# EAGLE design ATmega128RFA1-DevBoard (EAGLE 7.5.0)
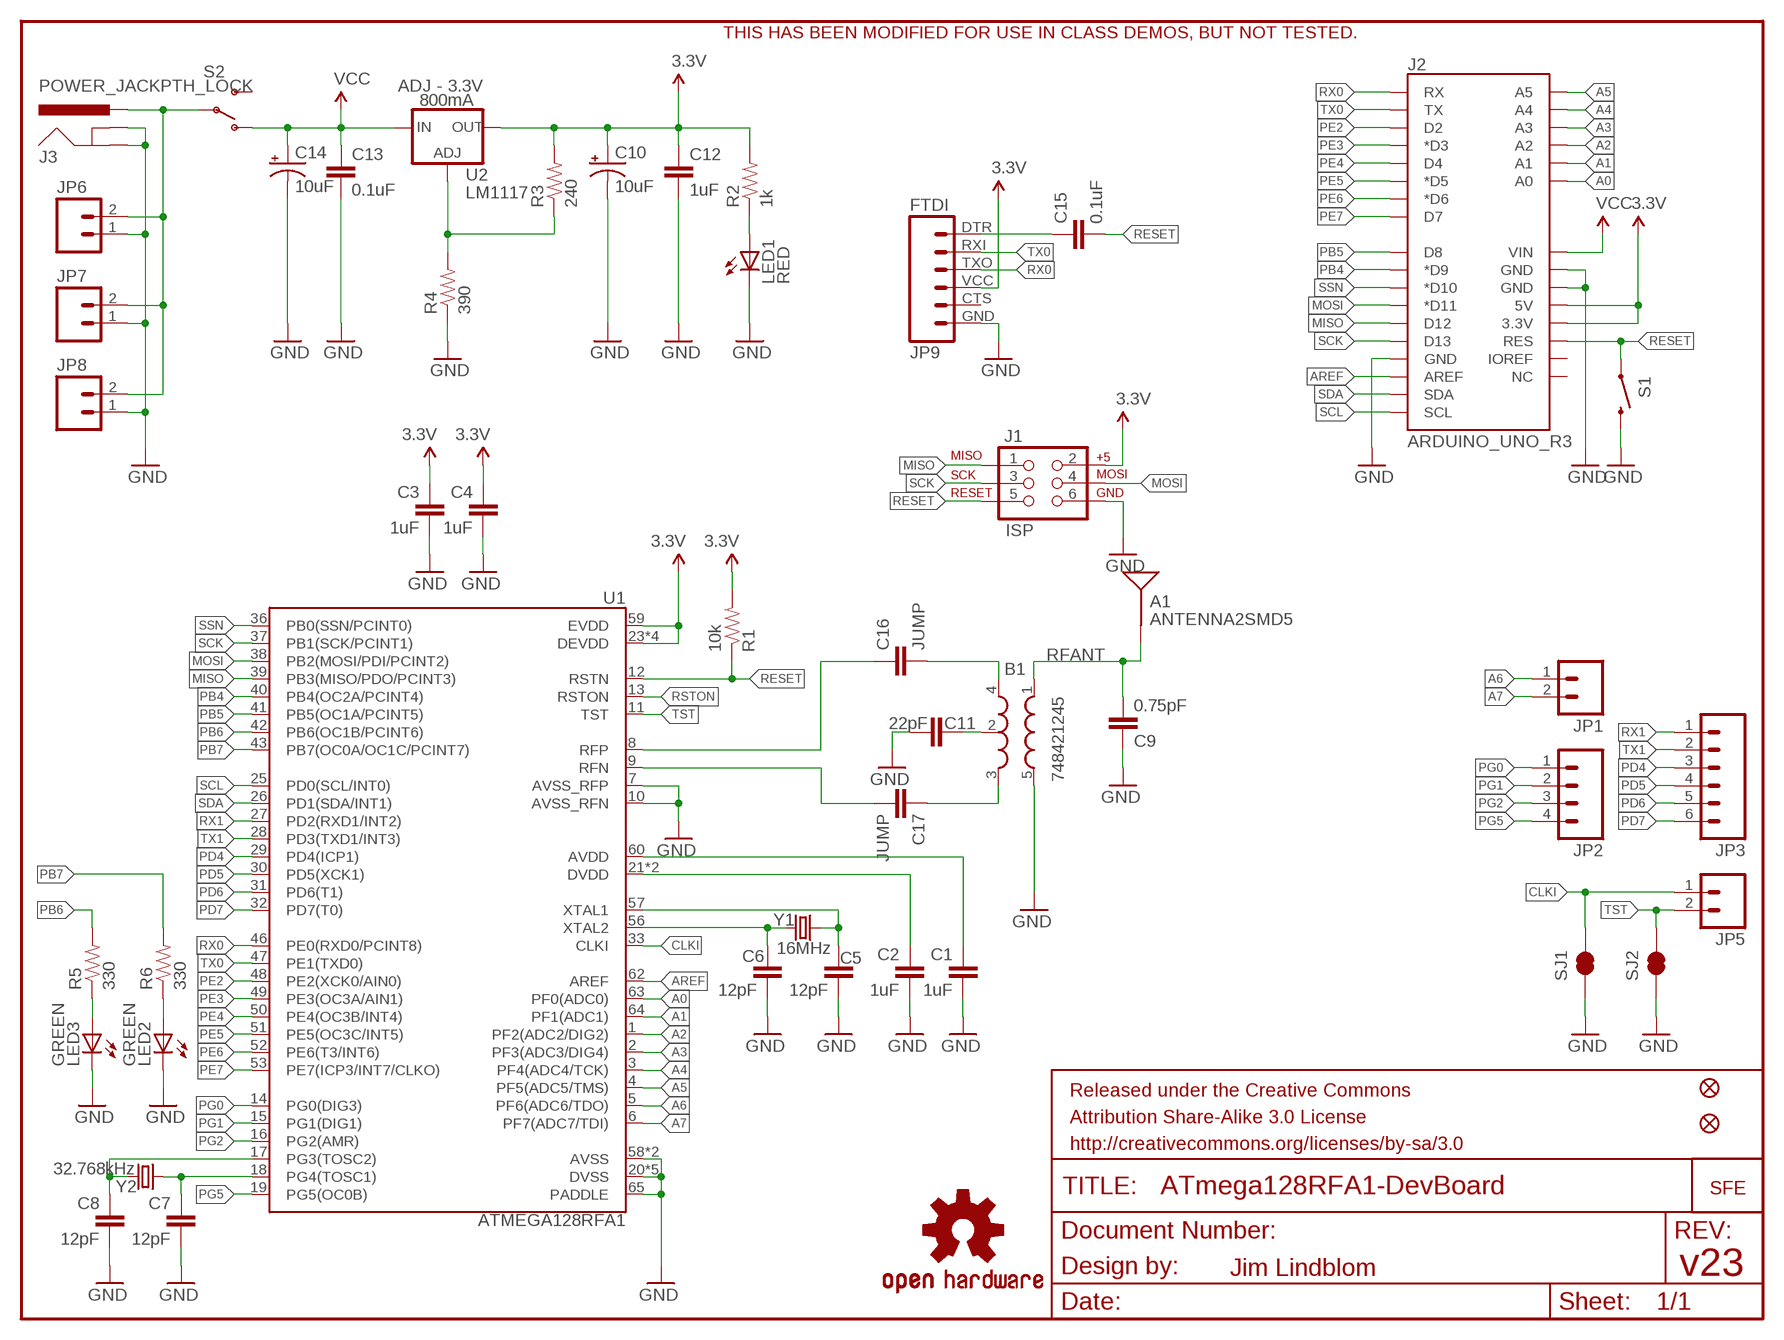
[diagram p0: schematic, sheet 1]

## Parts
A1  ANTENNA2SMD5  [ANTENNA-CHIP5]
B1  748421245  BALUN0805  [BALUN]
C1  1uF  CAP0402-CAP  [0402-CAP]
C2  1uF  CAP0402-CAP  [0402-CAP]
C3  1uF  CAP0402-CAP  [0402-CAP]
C4  1uF  CAP0402-CAP  [0402-CAP]
C5  12pF  CAP0402-CAP  [0402-CAP]
C6  12pF  CAP0402-CAP  [0402-CAP]
C7  12pF  CAP0402-CAP  [0402-CAP]
C8  12pF  CAP0402-CAP  [0402-CAP]
C9  0.75pF  CAP0402-CAP  [0402-CAP]
C10  10uF  CAP_POL1206  [EIA3216]
C11  22pF  CAP0402-CAP  [0402-CAP]
C12  1uF  CAP0402-CAP  [0402-CAP]
C13  0.1uF  CAP0402-CAP  [0402-CAP]
C14  10uF  CAP_POL1206  [EIA3216]
C15  0.1uF  CAP0402-CAP  [0402-CAP]
C16  JUMP  CAP0402-CAP  [0402-CAP]
C17  JUMP  CAP0402-CAP  [0402-CAP]
FID1  FIDUCIALUFIDUCIAL  [MICRO-FIDUCIAL]
FID2  FIDUCIALUFIDUCIAL  [MICRO-FIDUCIAL]
J1  ISP  AVR_SPI_PRG_6NS  [2X3-NS]
J2  ARDUINO_UNO_R3  [ARDUINO_UNO_R3]
J3  POWER_JACKPTH_LOCK  [POWER_JACK_PTH_LOCK]
JP1  M021X02_NO_SILK  [1X02_NO_SILK]
JP2  M041X04_NO_SILK  [1X04_NO_SILK]
JP3  M06SIP-NS  [1X06_NS]
JP4  LOGO-SFENEW  [SFE-NEW-WEBLOGO]
JP5  M021X02_NO_SILK  [1X02_NO_SILK]
JP6  M02JST-PTH-2  [JST-2-PTH]
JP7  M021X02_NO_SILK  [1X02_NO_SILK]
JP8  M023.5MM-NO_SILK  [SCREWTERMINAL-3.5MM-2-NS]
JP9  FTDI  FTDI_BASICPTH  [FTDI_BASIC]
LED1  RED  LED0603  [LED-0603]
LED2  GREEN  LED0603  [LED-0603]
LED3  GREEN  LED0603  [LED-0603]
R1  10k  RESISTOR0402-RES  [0402-RES]
R2  1k  RESISTOR0402-RES  [0402-RES]
R3  240  RESISTOR0402-RES  [0402-RES]
R4  390  RESISTOR0402-RES  [0402-RES]
R5  330  RESISTOR0402-RES  [0402-RES]
R6  330  RESISTOR0402-RES  [0402-RES]
S1  SWITCH-MOMENTARY-2SMD  [TACTILE_SWITCH_SMD]
S2  SWITCH-SPST-SMD-A  [SWITCH-SPST-SMD-A]
SJ1  SOLDERJUMPERTRACE  [SJ_2S-TRACE]
SJ2  SOLDERJUMPERTRACE  [SJ_2S-TRACE]
U1  ATMEGA128RFA1  [QFN-64]
U2  LM1117  V_REG_317SMD  [SOT223]
U$1  OSHW-LOGOS  [OSHW-LOGO-S]
Y1  16MHz  CRYSTAL5X3  [CRYSTAL-SMD-5X3]
Y2  32.768kHz  CRYSTAL32-SMD  [CRYSTAL-32KHZ-SMD]

## Nets
3.3V: C3.1 C4.1 C10.A(+) C12.1 J1.2 J2.3.3V J2.5V JP9.VCC R1.2 R2.2 R3.2 U1.23(DEVDD) U1.34(DEVDD) U1.44(DEVDD) U1.54(DEVDD) U1.59(EVDD) U2.2(OUT)
A0: J2.A0 U1.63(PF0(ADC0))
A1: J2.A1 U1.64(PF1(ADC1))
A2: J2.A2 U1.1(PF2(ADC2/DIG2))
A3: J2.A3 U1.2(PF3(ADC3/DIG4))
A4: J2.A4 U1.3(PF4(ADC4/TCK))
A5: J2.A5 U1.4(PF5(ADC5/TMS))
A6: JP1.1 U1.5(PF6(ADC6/TDO))
A7: JP1.2 U1.6(PF7(ADC7/TDI))
AREF: J2.AREF U1.62(AREF)
AVDD: C1.1 U1.60(AVDD)
CLKI: JP5.1 SJ1.2 U1.33(CLKI)
DTR: C15.1 JP9.DTR
DVDD: C2.1 U1.21(DVDD) U1.22(DVDD)
FB: R3.1 R4.2 U2.1(ADJ)
GND: B1.5(GND) C1.2 C2.2 C3.2 C4.2 C5.2 C6.2 C7.2 C8.2 C9.1 C10.C(-) C11.2 C12.2 C13.2 C14.C(-) J1.6 J2.GND@0(GND) J2.GND@1(GND) J2.GND@2(GND) J3.GND J3.GNDBREAK JP6.1 JP7.1 JP8.1 JP9.GND LED1.C LED2.C LED3.C R4.1 S1.3 SJ1.1 SJ2.1 U1.7(AVSS_RFP) U1.10(AVSS_RFN) U1.20(DVSS) U1.24(DVSS) U1.35(DVSS) U1.45(DVSS) U1.55(DVSS) U1.58(AVSS) U1.61(AVSS) U1.65(PADDLE)
MISO: J1.1 J2.D12 U1.39(PB3(MISO/PDO/PCINT3))
MOSI: J1.4 J2.D11(*D11) U1.38(PB2(MOSI/PDI/PCINT2))
N$2: LED1.A R2.1
N$3: C5.1 U1.57(XTAL1) Y1.3
N$4: C6.1 U1.56(XTAL2) Y1.1
N$5: C7.1 U1.18(PG4(TOSC1)) Y2.X1
N$6: C8.1 U1.17(PG3(TOSC2)) Y2.X2
N$7: B1.2(GND) C11.1
N$8: LED3.A R5.1
N$9: J3.PWR JP6.2 JP7.2 JP8.2 S2.2(P)
N$10: B1.4(OUT1) C16.2
N$11: B1.3(OUT2) C17.1
N$13: LED2.A R6.1
PB4: J2.D9(*D9) U1.40(PB4(OC2A/PCINT4))
PB5: J2.D8 U1.41(PB5(OC1A/PCINT5))
PB6: R5.2 U1.42(PB6(OC1B/PCINT6))
PB7: R6.2 U1.43(PB7(OC0A/OC1C/PCINT7))
PD4: JP3.3 U1.29(PD4(ICP1))
PD5: JP3.4 U1.30(PD5(XCK1))
PD6: JP3.5 U1.31(PD6(T1))
PD7: JP3.6 U1.32(PD7(T0))
PE2: J2.D2 U1.48(PE2(XCK0/AIN0))
PE3: J2.D3(*D3) U1.49(PE3(OC3A/AIN1))
PE4: J2.D4 U1.50(PE4(OC3B/INT4))
PE5: J2.D5(*D5) U1.51(PE5(OC3C/INT5))
PE6: J2.D6(*D6) U1.52(PE6(T3/INT6))
PE7: J2.D7 U1.53(PE7(ICP3/INT7/CLKO))
PG0: JP2.1 U1.14(PG0(DIG3))
PG1: JP2.2 U1.15(PG1(DIG1))
PG2: JP2.3 U1.16(PG2(AMR))
PG5: JP2.4 U1.19(PG5(OC0B))
RESET: C15.2 J1.5 J2.RES R1.1 S1.1 U1.12(RSTN)
RFANT: A1.FEED(SIGNAL) B1.1(IN) C9.2
RFN: C17.2 U1.9(RFN)
RFP: C16.1 U1.8(RFP)
RSTON: U1.13(RSTON)
RX0: J2.RX JP9.TXO U1.46(PE0(RXD0/PCINT8))
RX1: JP3.1 U1.27(PD2(RXD1/INT2))
SCK: J1.3 J2.D13 U1.37(PB1(SCK/PCINT1))
SCL: J2.SCL U1.25(PD0(SCL/INT0))
SDA: J2.SDA U1.26(PD1(SDA/INT1))
SSN: J2.D10(*D10) U1.36(PB0(SSN/PCINT0))
TST: JP5.2 SJ2.2 U1.11(TST)
TX0: J2.TX JP9.RXI U1.47(PE1(TXD0))
TX1: JP3.2 U1.28(PD3(TXD1/INT3))
VCC: C13.1 C14.A(+) J2.VIN S2.1(O) U2.3(IN)
Unconnected: J2.IOREF J2.NC JP9.CTS S2.3(S)

## Notes on the sheet
- THIS HAS BEEN MODIFIED FOR USE IN CLASS DEMOS, BUT NOT TESTED.
- ADJ - 3.3V
- 800mA
- Jim Lindblom | v23

## Library data of the parts
A1 = ATmega128RFA1-DevBoard.lbr:ANTENNA2: Chip antenna Single endded antenna. Common with smaller chip antennas. CHIP4 package is the GPS Chip Antenna SKU: GPS-08418. CHIP5 package is 2.4GHz chip antenna SKU: WRL-00144.
B1 = ATmega128RFA1-DevBoard.lbr:BALUN: 0805 footprint balun- Ember 351/357
C1-C9 C11-C13 C15-C17 = ATmega128RFA1-DevBoard.lbr:CAP: Capacitor Standard 0603 ceramic capacitor, and 0.1" leaded capacitor.
C10 C14 = ATmega128RFA1-DevBoard.lbr:CAP_POL: Capacitor Polarized These are standard SMD and PTH capacitors. Normally 10uF, 47uF, and 100uF in electrolytic and tantalum varieties. Always verify the external diameter of the through hole cap, it varies with capacity, voltage, and manufacturer. The EIA devices should be standard.
FID1 FID2 = ATmega128RFA1-DevBoard.lbr:FIDUCIAL: Fiducial Alignment Points Various fiducial points for machine vision alignment.
J1 = ATmega128RFA1-DevBoard.lbr:AVR_SPI_PRG_6: AVR ISP 6 Pin This is the reduced ISP connector for AVR programming. Common on Arduino. This footprint will take up less PCB space and can be used with a 10-pin to 6-pin adapter such as SKU: BOB-08508
J2 = ATmega128RFA1-DevBoard.lbr:ARDUINO_UNO_R3: Arduino Uno R3 This includes the two extra pins on the 8-AREF header (SDA and SCL), as well as the 2 extra pins on the power header (IOREF and NC).
J3 = ATmega128RFA1-DevBoard.lbr:POWER_JACK: Power Jack This is the standard 5.5mm barrel jack for power. The PTH is the most common, proven, reliable, footprint. The Slot footprint only works if the mill layer is transmitted to the PCB fab house so be warned. Spark Fun Electronics SKU : PRT-00119 SMT: CONN-08106 Mating wall wart : TOL-00298 (and others)
JP1 JP5-JP8 = ATmega128RFA1-DevBoard.lbr:M02: Header 2 Standard 2-pin 0.1" header. Use with straight break away headers (SKU : PRT-00116), right angle break away headers (PRT-00553), swiss pins (PRT-00743), machine pins (PRT-00117), and female headers (PRT-00115). Molex polarized connector foot print use with SKU : PRT-08233 with associated crimp pins and housings.
JP2 = ATmega128RFA1-DevBoard.lbr:M04: Header 4 Standard 4-pin 0.1" header. Use with straight break away headers (SKU : PRT-00116), right angle break away headers (PRT-00553), swiss pins (PRT-00743), machine pins (PRT-00117), and female headers (PRT-00115). Molex polarized connector foot print use with SKU : PRT-08231 with associated crimp pins and housings. 1MM SMD Version SKU: PRT-10208
JP3 = ATmega128RFA1-DevBoard.lbr:M06: Header 6 Standard 6-pin 0.1" header. Use with straight break away headers (SKU : PRT-00116), right angle break away headers (PRT-00553), swiss pins (PRT-00743), machine pins (PRT-00117), and female headers (PRT-00115). Molex polarized connector foot print use with SKU : PRT-08094 with associated crimp pins and housings. NOTES ON THE VARIANTS LOCK and LOCK_LONGPADS... This footprint was designed to help hold the alignment of a through-hole component (i.e. 6-pin header) while soldering it into place. You may notice that each hole has been shifted either up or down by 0.005 of an inch from it's more standard position (which is a perfectly straight line). This slight alteration caused the pins (the squares in the middle) to touch the edges of the holes. Because they are alternating, it causes a "brace" to hold the component in place. 0.005 has proven to be the perfect amount of "off-center" position when using our standard breakaway headers. Although looks a little odd when you look at the bare footprint, once you have a header in there, the alteration is very hard to notice. Also, if you push a header all the way into place, it is covered up entirely on the bottom side. This idea of altering the position of holes to aid alignment will be further integrated into the Sparkfun Library for other footprints. It can help hold any component with 3 or more connection pins.
JP4 = ATmega128RFA1-DevBoard.lbr:LOGO-SFE: Spark Fun Electronics PCB Logo This is the standard Spark Fun Electronics PCB logo.
JP9 = ATmega128RFA1-DevBoard.lbr:FTDI_BASIC: FTDI Basic header with labels
LED1-LED3 = ATmega128RFA1-DevBoard.lbr:LED: LEDs Standard schematic elements and footprints for 5mm, 3mm, 1206, and 0603 sized LEDs. 5mm - Spark Fun Electronics SKU : COM-00529 (and others)
R1-R6 = ATmega128RFA1-DevBoard.lbr:RESISTOR: Resistor Basic schematic elements and footprints for 0603, 1206, and PTH resistors.
S1 = ATmega128RFA1-DevBoard.lbr:SWITCH-MOMENTARY-2: Various NO switches- pushbuttons, reed, etc
S2 = ATmega128RFA1-DevBoard.lbr:SWITCH-SPST: SPST Switch Simple slide switch. Spark Fun Electronics SKU : COM-00102
SJ1 SJ2 = ATmega128RFA1-DevBoard.lbr:SOLDERJUMPER: Solder Jumper Standard SMD solder jumper. Used to automate production. Two varients : Normally Open and Normally Closed are the same, but have different paste layers. NC will have a large amount of paste and should jumper during reflow.
U1 = ATmega128RFA1-DevBoard.lbr:ATMEGA128RFA1: ATmega128RFA1 8-bit AVR Microcontroller with Low Power 2.4GHz Transceiver for ZigBee and IEEE 802.15.4
U2 = ATmega128RFA1-DevBoard.lbr:V_REG_317: Voltage Regulator Standard LM317 adjustable voltage regulator. AOI (Adjust Output Input). Google 'LM317 Calculator' for easy to use app to get the two resistor values needed. 240/720 for 5V output. 240/390 for 3.3V output. Spark Fun Electronics SKU : COM-00527
U$1 = ATmega128RFA1-DevBoard.lbr:OSHW-LOGO: Open Source Hardware Logo This logo indicates the piece of hardware it is found on incorporates a OSHW license and/or adheres to the definition of open source hardware found here: http://freedomdefined.org/OSHW
Y1 Y2 = ATmega128RFA1-DevBoard.lbr:CRYSTAL: Various standard crystals. Proven footprints. Spark Fun Electronics SKU : COM-00534

## Net classes
1 Wide: width 2 mm

## Board
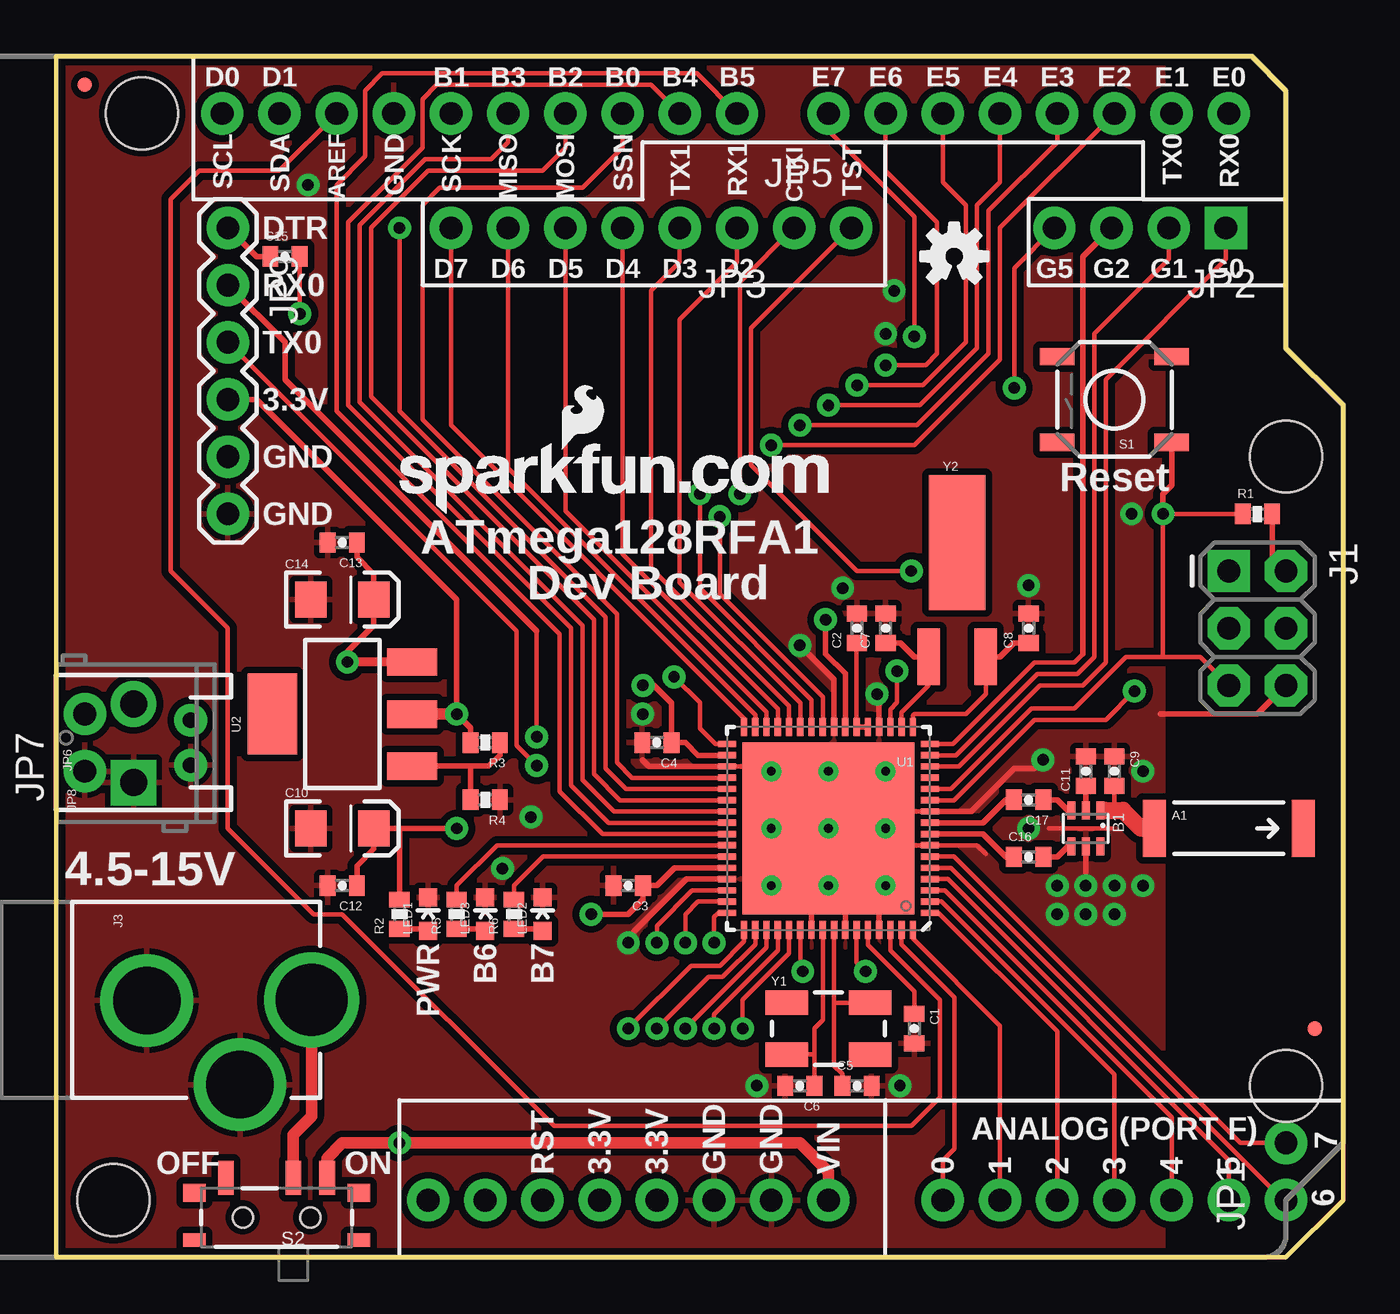
[diagram p1: board, top side]
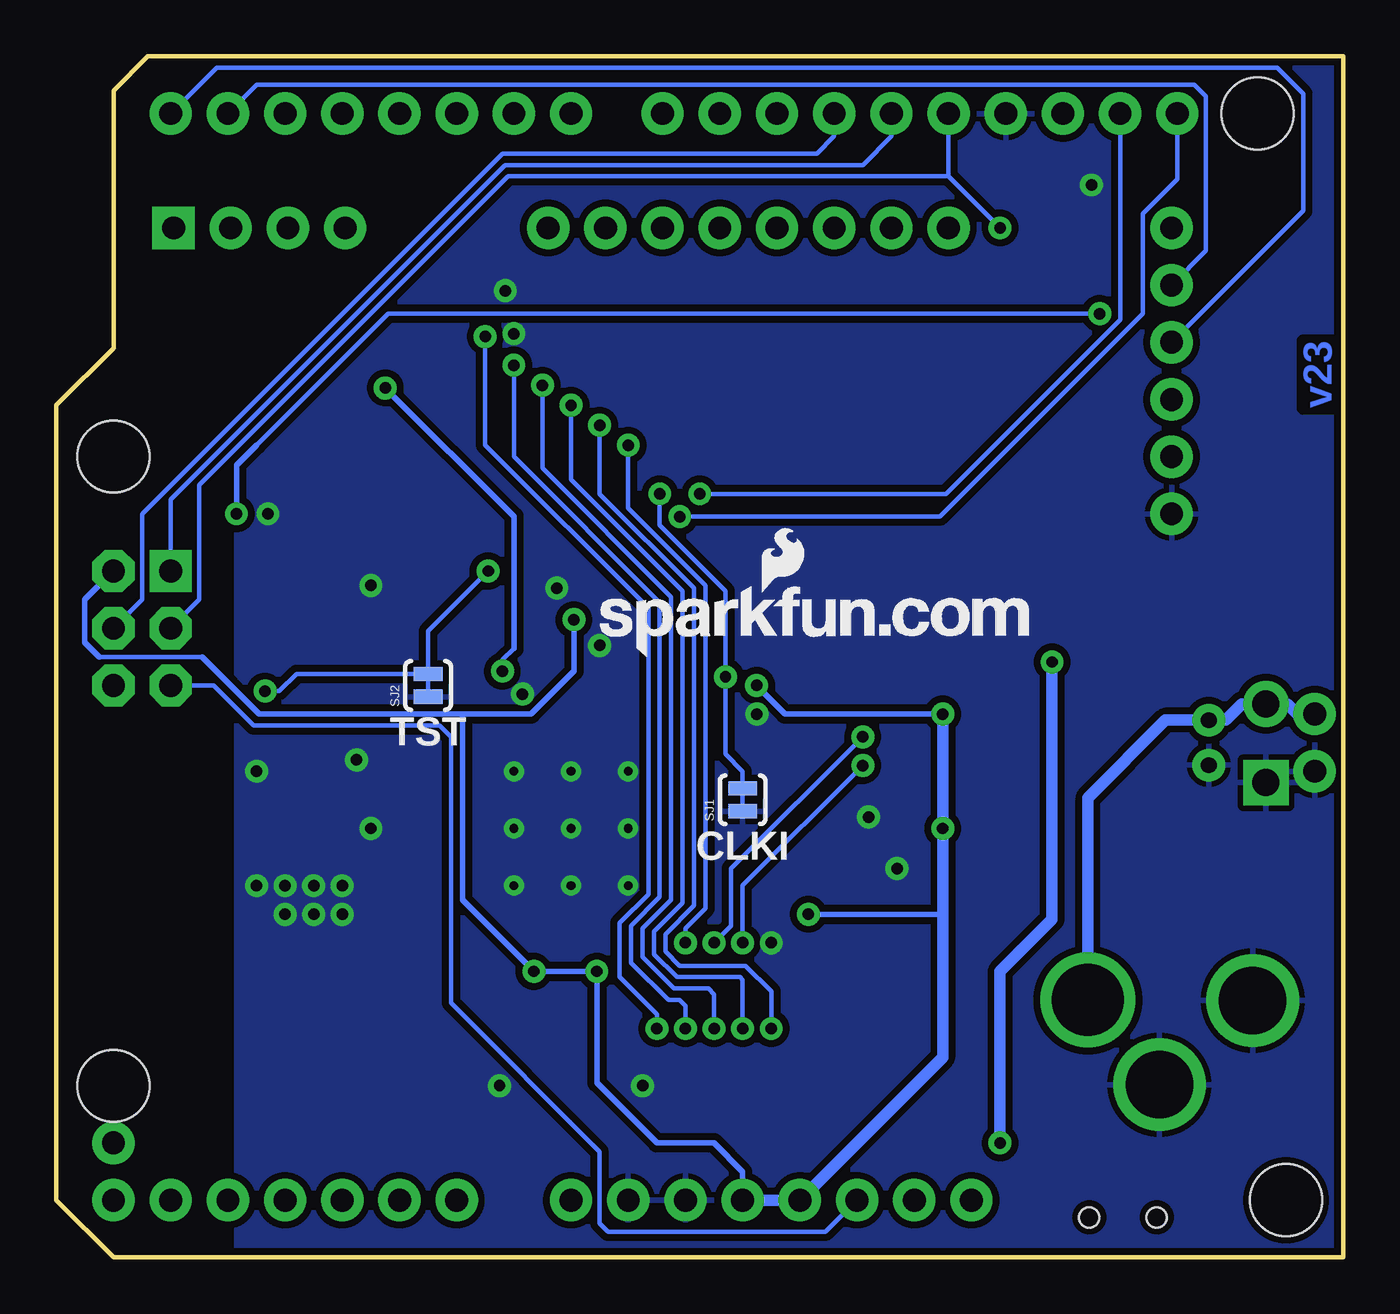
[diagram p2: board, bottom side, seen from below]

Size 57.15 x 53.34 mm. Coordinates in mm from the lower left corner, seen from the top.
Outline: 0,53.34 0,0 54.61,0 57.15,2.54 57.15,37.85 54.61,40.39 54.61,51.82 53.09,53.34 0,53.34
Copper layers (1*16): Top 0.035mm / dielectric 1.5mm / Bottom 0.035mm
Design rules "SparkFun": minimum track width 7mil, minimum drill 15mil, track to track 8mil, track to pad 8mil, pad to pad 8mil, via to via 8mil, smd to smd 8mil, copper to edge 8mil, drill to drill 8mil, minimum pad ring 12mil, minimum via ring 10mil, stop-mask expansion 4mil, vias tented up to drill 20mil, thermal gap 10mil

### Footprints (pad centres in the part's own frame; a part is rotated, then mirrored left to right if it is on the bottom)
ANTENNA-CHIP5 = smd 1.016 x 2.54: FEED -3.302,0; NC 3.302,0
BALUN = smd 0.35 x 0.8: 1 -0.65,-0.8; 2 0,-0.8; 3 0.65,-0.8; 4 0.65,0.8; 5 0,0.8; 6 -0.65,0.8
0402-CAP = smd 0.7 x 0.9: 1 -0.65,0; 2 0.65,0
EIA3216 = smd 1.4 x 1.6: A 1.4,0; C -1.4,0
MICRO-FIDUCIAL = smd 0.635 x 0.635: 1 0,0
2X3-NS = drill 1.016 pad 1.88 square: 1 -2.54,-1.27 | drill 1.016 pad 1.88 octagon: 2 -2.54,1.27; 3 0,-1.27; 4 0,1.27; 5 2.54,-1.27; 6 2.54,1.27
ARDUINO_UNO_R3 = drill 1.016 pad 1.88: 3.3V 35.56,2.54; 5V 38.1,2.54; A0 50.8,2.54; A1 53.34,2.54; A2 55.88,2.54; A3 58.42,2.54; A4 60.96,2.54; A5 63.5,2.54; AREF 23.876,50.8; D2 58.42,50.8; D3 55.88,50.8; D4 53.34,50.8; D5 50.8,50.8; D6 48.26,50.8; D7 45.72,50.8; D8 41.656,50.8; D9 39.116,50.8; D10 36.576,50.8; D11 34.036,50.8; D12 31.496,50.8; D13 28.956,50.8; GND@0 40.64,2.54; GND@1 43.18,2.54; GND@2 26.416,50.8; IOREF 30.48,2.54; NC 27.94,2.54; RES 33.02,2.54; RX 63.5,50.8; SCL 18.796,50.8; SDA 21.336,50.8; TX 60.96,50.8; VIN 45.72,2.54 | hole 3.2: 15.24,50.8; 13.97,2.54; 66.04,7.62; 66.04,35.56
POWER_JACK_PTH_LOCK = drill 2.997 pad 4.115: GND 0.025,6.557; GNDBREAK 3.762,10.7 | drill 3.2 pad 4.115: PWR 0,13.878
1X02_NO_SILK = drill 1.016 pad 1.88: 1 0,0; 2 2.54,0
1X04_NO_SILK = drill 1.016 pad 1.88 square: 1 0,0 | drill 1.016 pad 1.88: 2 2.54,0; 3 5.08,0; 4 7.62,0
1X06_NS = drill 1.016 pad 1.88: 1 0,0; 2 2.54,0; 3 5.08,0; 4 7.62,0; 5 10.16,0; 6 12.7,0
JST-2-PTH = drill 0.7 pad 1.448: 1 -1,0; 2 1,0
SCREWTERMINAL-3.5MM-2-NS = drill 1.2 pad 2.032 square: 1 0,0 | drill 1.2 pad 2.032: 2 3.5,0
FTDI_BASIC = drill 1.016 pad 1.88: CTS 10.16,0; DTR 0,0; GND 12.7,0; RXI 2.54,0; TXO 5.08,0; VCC 7.62,0
LED-0603 = smd 0.8 x 0.8: A 0,-0.75; C 0,0.75
0402-RES = smd 0.7 x 0.9: 1 -0.65,0; 2 0.65,0
TACTILE_SWITCH_SMD = smd 1.524 x 0.762: 1 -2.54,1.905; 2 2.54,1.905; 3 -2.54,-1.905; 4 2.54,-1.905
SWITCH-SPST-SMD-A = smd 0.7 x 1.5: 1 -2.25,-1.75; 2 -0.75,-1.75; 3 2.25,-1.75 | smd 1 x 0.6: GND1 -3.65,1; GND3 3.65,1 | smd 1 x 0.8: GND2 -3.65,-1.1; GND4 3.65,-1.1 | hole 0.9: -1.5,0; 1.5,0
SJ_2S-TRACE = smd 0.635 x 1.27: 1 -0.508,0; 2 0.508,0
QFN-64 = smd 0.8 x 0.28: 1 -4.5,3.75; 2 -4.5,3.25; 3 -4.5,2.75; 4 -4.5,2.25; 5 -4.5,1.75; 6 -4.5,1.25; 7 -4.5,0.75; 8 -4.5,0.25; 9 -4.5,-0.25; 10 -4.5,-0.75; 11 -4.5,-1.25; 12 -4.5,-1.75; 13 -4.5,-2.25; 14 -4.5,-2.75; 15 -4.5,-3.25; 16 -4.5,-3.75; 33 4.5,-3.75; 34 4.5,-3.25; 35 4.5,-2.75; 36 4.5,-2.25; 37 4.5,-1.75; 38 4.5,-1.25; 39 4.5,-0.75; 40 4.5,-0.25; 41 4.5,0.25; 42 4.5,0.75; 43 4.5,1.25; 44 4.5,1.75; 45 4.5,2.25; 46 4.5,2.75; 47 4.5,3.25; 48 4.5,3.75 | smd 0.28 x 0.8: 17 -3.75,-4.5; 18 -3.25,-4.5; 19 -2.75,-4.5; 20 -2.25,-4.5; 21 -1.75,-4.5; 22 -1.25,-4.5; 23 -0.75,-4.5; 24 -0.25,-4.5; 25 0.25,-4.5; 26 0.75,-4.5; 27 1.25,-4.5; 28 1.75,-4.5; 29 2.25,-4.5; 30 2.75,-4.5; 31 3.25,-4.5; 32 3.75,-4.5; 49 3.75,4.5; 50 3.25,4.5; 51 2.75,4.5; 52 2.25,4.5; 53 1.75,4.5; 54 1.25,4.5; 55 0.75,4.5; 56 0.25,4.5; 57 -0.25,4.5; 58 -0.75,4.5; 59 -1.25,4.5; 60 -1.75,4.5; 61 -2.25,4.5; 62 -2.75,4.5; 63 -3.25,4.5; 64 -3.75,4.5 | smd 7.65 x 7.65: 65 0,0
SOT223 = smd 1.219 x 2.235: 1 -2.311,-3.099; 2 0,-3.099; 3 2.311,-3.099 | smd 3.6 x 2.2: 4 0,3.099
CRYSTAL-SMD-5X3 = smd 1.9 x 1.1: 1 -1.85,-1.15; 2 1.85,-1.15; 3 1.85,1.15; 4 -1.85,1.15
CRYSTAL-32KHZ-SMD = smd 2.5 x 6: SHEILD 0,5.08 | smd 1 x 2.5: X1 -1.27,0; X2 1.27,0

### Placement (x,y rotation side)
A1  52.07,19.05 0 top
B1  45.72,19.05 180 top
C1  38.1,10.16 270 top
C2  35.56,27.94 90 top
C3  25.4,16.51 180 top
C4  26.67,22.86 180 top
C5  35.56,7.62 0 top
C6  33.02,7.62 180 top
C7  36.83,27.94 90 top
C8  43.18,27.94 90 top
C9  46.99,21.59 270 top
C10  12.7,19.05 0 top
C11  45.72,21.59 90 top
C12  12.7,16.51 180 top
C13  12.7,31.75 180 top
C14  12.7,29.21 0 top
C15  10.16,44.45 0 top
C16  43.18,17.78 0 top
C17  43.18,20.32 180 top
FID1  1.27,52.07 0 top
FID2  55.88,10.16 0 top
J1  53.34,27.94 270 top
J2  -11.43,0 0 top
J3  -2.54,11.43 270 top
JP1  54.61,2.54 90 top
JP2  51.94,45.72 180 top
JP3  30.23,45.72 180 top
JP4  33.02,26.67 0 bottom
JP5  32.77,45.72 0 top
JP6  5.97,22.86 90 top
JP7  1.27,21.59 90 top
JP8  3.43,21.08 90 top
JP9  7.62,45.72 270 top
JP10  LOGO-SFENEW  [SFE-NEW-WEBLOGO]  15.24,33.02 0 top
LED1  16.51,15.24 0 top
LED2  21.59,15.24 0 top
LED3  19.05,15.24 0 top
R1  53.34,33.02 0 top
R2  15.24,15.24 90 top
R3  19.05,22.86 180 top
R4  19.05,20.32 180 top
R5  17.78,15.24 90 top
R6  20.32,15.24 90 top
S1  46.99,38.1 180 top
S2  9.78,1.78 180 top
SJ1  26.67,20.32 90 bottom
SJ2  40.64,25.4 90 bottom
U1  34.29,19.05 180 top
U2  12.7,24.13 90 top
U$1  39.88,44.45 0 top
Y1  34.29,10.16 0 top
Y2  40.01,26.67 0 top

### Tracks (layer width: path | path; a pad name or v marks a point on that pad's centre or on a via)
3.3V  (via drill 0.51)
  Top 0.203: U1.54 33.04,12.81 v33.15,12.7 | U1.59 35.54,13.1 v35.94,12.7
  Top 0.254: U1.34 28.5,22.3 27.94,22.86 C4.1 27.32,24.62 26.54,25.4 v26.05,25.4 | U1.44 27.46,17.3 26.67,16.51 C3.1 26.05,15.89 25.4,15.24 v23.75,15.24 | 15.24,19.05 C10.A 14.1,18.13 13.35,17.38 C12.1 | 15.24,19.05 v17.78,19.05 | R1.2 53.99,31.1 J1.2 | R2.2 15.24,19.05 | JP9.VCC 8.89,38.1 17.78,29.21 v17.78,24.13 18.4,23.51 R3.2 | U1.23 35.04,25.92 34.16,26.8 v34.16,28.32
  Top 0.508: U2.2 v17.78,24.13
  Bottom 0.203: 50.67,26.67 55.24,26.67
  Bottom 0.254: v23.75,15.24 17.78,15.24 | 39.12,24.13 39.12,15.88 v35.94,12.7 v33.15,12.7 33.15,7.75 30.48,5.08 27.94,5.08 26.67,3.81 J2.5V | 39.12,24.13 36.07,24.13 34.16,26.04 v34.16,28.32 | 39.12,24.13 48.13,24.13 50.67,26.67 | 55.24,26.67 55.88,27.3 55.88,29.21 J1.2 | v17.78,24.13 24.78,24.13 v26.05,25.4
  Bottom 0.508: v17.78,24.13 v17.78,19.05 17.78,15.24 17.78,8.89 J2.3.3V J2.5V
A0
  Top 0.203: J2.A0 39.37,4.32 39.88,4.83 39.88,11.56 37.54,13.89 U1.63
A1
  Top 0.203: J2.A1 41.91,10.29 38.04,14.16 U1.64
A2
  Top 0.203: U1.1 39.18,15.3 44.45,10.03 J2.A2
A3
  Top 0.203: U1.2 39.32,15.8 46.99,8.13 J2.A3
A4
  Top 0.203: U1.3 39.45,16.3 49.53,6.22 J2.A4
A5
  Top 0.203: U1.4 39.59,16.8 52.07,4.32 J2.A5
A6
  Top 0.203: U1.5 39.72,17.3 54.48,2.54 JP1.1
A7
  Top 0.203: U1.6 39.86,17.8 52.58,5.08 JP1.2
AREF
  Top 0.203: J2.AREF 9.91,48.26 6.35,48.26 5.08,46.99 5.08,30.48 7.62,27.94 7.62,19.05 11.43,15.24 12.7,15.24 22.1,5.84 37.97,5.84 39.24,7.11 39.24,11.43 37.04,13.63 U1.62
AVDD
  Top 0.203: U1.60 36.04,13.87 38.1,11.81 C1.1
CLKI  (via drill 0.51)
  Top 0.203: v30.35,33.91 30.35,43.31 JP5.1 | U1.33 29.27,22.8 28.57,23.5 28.57,24.64 v27.43,25.78
  Bottom 0.203: SJ1.2 26.67,21.59 27.43,22.35 v27.43,25.78 27.43,29.59 30.35,32.51 v30.35,33.91
DTR
  Top 0.254: C15.1 8.89,44.45 JP9.DTR
DVDD
  Top 0.203: U1.22 35.54,27.16
  Top 0.254: U1.21 U1.22 | 35.54,27.16 35.56,27.18 C2.1
FB
  Top 0.254: R3.1 19.7,22.32 19.2,21.82 18.4,21.82 | R4.2 18.4,21.82 | 18.4,21.82 U2.1
GND  (via drill 0.38, 0.51)
  Top 0.203: 35.97,19.05 v36.83,19.05 37.58,18.3 U1.7 40.88,18.3 41.27,17.91 | v36.83,21.59 v34.29,21.59 v31.75,21.59 31.54,21.8 U1.35 | 36.32,15.49 36.32,16 v36.83,16.51 36.54,16.22 36.54,15.46 | 35.04,15.48 35.04,15.76 v34.29,16.51 | U1.10 37.58,19.8 | 46.86,19.05 44.07,19.05
  Top 0.254: 39.26,19.8 39.24,19.81 | U1.10 39.37,19.8 | 39.37,19.8 40.63,19.8 42.55,21.72 43.43,21.72 v43.81,22.1 | U1.61 36.54,15.46 | U1.58 35.04,15.48 | U1.55 33.54,15.48 34.29,16.23 v34.29,16.51 v31.75,16.51 | U1.24 34.54,25.66 v33.02,27.18 | U1.35 26.33,21.8 26.04,22.1 | U1.45 27.98,16.8 25.65,14.48 | 37.58,19.8 v36.83,19.05 | 38.86,19.81 39.24,19.81 | 39.36,19.81 40.13,19.81 | B1.5 v45.72,16.51 | J1.6 53.34,24.13 49.02,24.13 | U1.20 36.54,24.93 v36.45,25.02 | 39.24,19.81 39.36,19.81 | 39.36,19.81 39.37,19.8
  other vias: 34.29,19.05 31.75,19.05 25.4,13.97 44.45,16.51 43.18,19.05 19.81,17.27 11.18,47.62 26.04,24.13 37.47,7.62 31.11,7.62 44.45,15.24 46.99,16.51 46.99,15.24 45.72,15.24 21.08,19.56 47.75,33.02 43.18,29.84 34.92,29.72 36.83,41.02 48.26,21.59 48.26,16.51 37.21,42.93
  pour Top (isolate 0.305, rank 2): 0,53.34 0,0 49.15,0 49.15,53.34
  pour Bottom (isolate 0.305): 0,53.34 49.15,53.34 49.15,0 0,0
MISO
  Top 0.203: U1.39 24.78,19.8 23.37,21.21 23.37,28.07 13.46,37.97 13.46,45.85 16.38,48.77 19.3,48.77 20.07,49.53 J2.D12
  Bottom 0.203: J1.1 52.07,33.66 37.21,48.51 21.34,48.51 20.07,49.78 J2.D12
MOSI
  Top 0.203: U1.38 25.04,20.3 23.88,21.46 23.88,28.32 13.97,38.23 13.97,45.72 16.51,48.26 21.59,48.26 22.61,49.28 J2.D11
  Bottom 0.203: J1.4 53.34,29.21 53.34,33.02 37.34,49.02 23.37,49.02 22.61,49.78 J2.D11
N$2
  Top 0.254: R2.1 16.41,14.59 LED1.A
N$3
  Top 0.203: C5.1 34.91,8.14 34.54,8.51 34.54,11.3 | U1.57 34.54,11.3 | 35.81,11.3 34.54,11.3
  Top 0.254: Y1.3 35.82,11.31 35.81,11.3
N$4
  Top 0.203: U1.56 34.04,10.54 33.67,10.18 33.67,9.02 | C6.1 33.67,9.02 | Y1.1 33.66,9.01 33.67,9.02
N$5
  Top 0.203: U1.18 37.54,24.2 38.73,25.4 Y2.X1
  Top 0.254: C7.1 37.48,27.29 38.1,26.67 Y2.X1
N$6
  Top 0.203: U1.17 38.04,24.07 38.1,24.13 40.39,24.13 41.27,25.02 Y2.X2
  Top 0.254: C8.1 42.53,27.29 41.91,26.67 Y2.X2
N$7
  Top 0.254: B1.2 C11.1
N$8
  Top 0.254: R5.1 18.95,14.59 LED3.A
N$9
  Top 0.508: S2.2 10.53,5.45 11.34,6.26 J3.PWR
  Bottom 0.508: JP7.2 2.03,24.13 2.48,24.58 JP8.2 4.5,24.58 5.22,23.86 JP6.2 7.89,23.86 11.34,20.41 J3.PWR
N$10
  Top 0.254: C16.2 44.45,17.78 44.92,18.25 B1.4
N$11
  Top 0.254: C17.1 44.45,20.32 44.92,19.85 B1.3
N$13
  Top 0.254: R6.1 21.49,14.59 LED2.A
PB4
  Top 0.203: U1.40 24.52,19.3 22.86,20.95 22.86,27.94 12.95,37.85 12.95,45.97 16.26,49.28 16.26,51.44 16.89,52.07 26.42,52.07 J2.D9
PB5
  Top 0.203: U1.41 24.25,18.8 22.35,20.7 22.35,27.69 12.45,37.59 12.45,47.62 13.72,48.9 13.72,51.82 14.48,52.58 28.45,52.58 J2.D8
PB6
  Top 0.203: U1.42 19.57,18.3 17.78,16.51 R5.2
PB7
  Top 0.203: U1.43 21.61,17.8 20.32,16.51 R6.2
PD4
  Top 0.203: U1.29 32.04,24.35 25.15,31.24 JP3.3
PD5
  Top 0.203: U1.30 31.54,24.21 22.61,33.15 JP3.4
PD6
  Top 0.203: U1.31 31.04,24.08 20.07,35.05 JP3.5
PD7
  Top 0.203: U1.32 30.54,23.94 17.53,36.96 JP3.6
PE2  (via drill 0.51)
  Top 0.203: v31.75,36.07 38.1,36.07 41.91,39.88 41.91,45.72 J2.D2 | v29.21,13.97 29.21,15.11 29.4,15.3 U1.48
  Bottom 0.203: v31.75,36.07 31.75,33.27 28.32,29.84 28.32,15.49 29.21,14.61 v29.21,13.97
PE3  (via drill 0.51)
  Top 0.203: v33.02,36.96 38.23,36.96 41.4,40.13 41.4,46.48 44.45,49.53 J2.D3 | U1.49 30.54,14.03 29.46,12.95 28.19,12.95 v25.4,10.16
  Bottom 0.203: v25.4,10.16 25.4,11.81 26.54,12.95 29.46,12.95 30.1,13.59 30.1,14.35 28.83,15.62 28.83,29.72 33.02,33.91 v33.02,36.96
PE4  (via drill 0.51)
  Top 0.203: v34.29,37.85 38.35,37.85 40.89,40.39 40.89,46.74 41.91,47.75 J2.D4 | U1.50 31.04,13.89 29.59,12.45 28.96,12.45 v26.67,10.16
  Bottom 0.203: v26.67,10.16 26.67,12.32 26.8,12.45 29.59,12.45 30.61,13.46 30.61,14.48 29.34,15.75 29.34,29.59 34.29,34.54 v34.29,37.85
PE5  (via drill 0.51)
  Top 0.203: v35.56,38.73 38.48,38.73 40.39,40.64 40.39,46.74 39.37,47.75 J2.D5 | U1.51 31.54,13.76 v27.94,10.16
  Bottom 0.203: v27.94,10.16 27.94,11.68 28.19,11.94 29.72,11.94 31.11,13.34 31.11,14.61 29.84,15.88 29.84,29.34 35.56,35.05 v35.56,38.73
PE6  (via drill 0.51)
  Top 0.203: v36.83,39.62 38.61,39.62 39.12,40.13 39.12,45.97 36.83,48.26 J2.D6 | U1.52 32.04,13.62 29.21,10.79 v29.21,10.16
  Bottom 0.203: v36.83,39.62 36.83,35.56 30.35,29.08 30.35,16 31.62,14.73 31.62,13.08 29.97,11.43 29.46,11.43 29.21,11.18 v29.21,10.16
PE7  (via drill 0.51)
  Top 0.203: J2.D7 34.29,50.04 38.1,46.23 v38.1,40.89 | U1.53 32.54,13.49 30.48,11.43 v30.48,10.16
  Bottom 0.203: v38.1,40.89 38.1,36.07 30.86,28.83 30.86,16.13 32.13,14.86 32.13,12.45 30.48,10.79 v30.48,10.16
PG0
  Top 0.203: U1.14 40.09,21.8 43.69,25.4 45.59,25.4 46.61,26.42 46.61,38.99 51.94,44.32 JP2.1
PG1
  Top 0.203: U1.15 39.95,22.3 43.56,25.91 45.34,25.91 46.1,26.67 46.1,41.02 49.4,44.32 JP2.2
PG2
  Top 0.203: U1.16 39.82,22.8 43.43,26.42 45.21,26.42 45.59,26.8
  Top 0.254: 45.59,26.8 45.59,44.45 JP2.3
PG5  (via drill 0.51)
  Top 0.203: U1.19 37.04,24.34 37.34,24.64 v37.34,26.04 | v42.55,38.61 42.55,43.94 JP2.4
  Bottom 0.203: v37.34,26.04 37.34,26.54 36.83,27.05
  Bottom 0.254: 36.83,27.05 36.83,32.89 v42.55,38.61
RESET  (via drill 0.51)
  Top 0.203: U1.12 39.72,20.8 43.31,24.38 45.21,24.38 47.5,26.67 49.15,26.67 | J1.5 50.8,26.67 49.15,26.67 | R1.1 v49.15,33.02 49.15,26.67 | C15.2 v10.81,41.91
  Top 0.254: v49.15,33.02 49.15,33.91 49.53,34.29 S1.1
  Bottom 0.203: J2.RES 22.99,1.14 32.64,1.14 33.02,1.52 33.02,4.7 39.62,11.3 39.62,23.11 40.13,23.62 48.39,23.62 50.16,25.4 J1.5 | v10.81,41.91 42.42,41.91 48.26,36.07
  Bottom 0.254: 48.26,36.07 49.15,35.18 v49.15,33.02
RFANT
  Top 0.203: C9.2 46.99,19.85
  Top 0.254: B1.1 46.57,19.85
  Top 0.762: 46.57,19.85 46.99,19.85 47.37,19.85 48.17,19.05 A1.FEED
RFN
  Top 0.254: U1.9 41.14,19.3 42.16,20.32 C17.2
RFP
  Top 0.254: U1.8 41.14,18.8 42.16,17.78 C16.1
RX0  (via drill 0.51)
  Top 0.203: U1.46 28.24,16.3 26.67,14.73 v26.67,13.97 | JP9.TXO 20.45,27.81 20.45,22.73 v21.34,21.84
  Bottom 0.203: v26.67,13.97 26.67,16.51 v21.34,21.84 | J2.RX 50.04,52.83 2.92,52.83 1.78,51.69 1.78,46.48 JP9.TXO
RX1
  Top 0.203: U1.27 33.04,24.62 27.69,29.97 27.69,41.66 30.23,44.2 JP3.1
SCK  (via drill 0.51)
  Top 0.203: U1.37 25.3,20.8 24.38,21.72 24.38,28.45 15.24,37.59 v15.24,45.72
  Bottom 0.203: v15.24,45.72 17.53,48.01 | J2.D13 17.53,48.01 | J1.3 50.8,29.21 50.8,34.29 37.08,48.01 17.53,48.01
SCL  (via drill 0.51)
  Top 0.203: U1.25 34.04,24.89 29.46,29.46 v29.46,32.89
  Bottom 0.203: v29.46,32.89 17.91,32.89 8.89,41.91 8.89,46.35 7.37,47.88 J2.SCL
SDA  (via drill 0.51)
  Top 0.203: U1.26 33.54,24.75 28.57,29.72 v28.57,33.91
  Bottom 0.203: v28.57,33.91 17.65,33.91 9.91,41.66 J2.SDA
SSN
  Top 0.203: U1.36 25.56,21.3 24.89,21.97 24.89,28.57 16.26,37.21 16.26,46.74 17.02,47.5 23.37,47.5 25.15,49.28 J2.D10
TST  (via drill 0.51)
  Top 0.203: U1.11 39.86,20.3 43.43,23.88 46.61,23.88 v47.88,25.15 | JP5.2 30.86,41.27 30.86,35.18 35.56,30.48 v37.97,30.48
  Bottom 0.203: v37.97,30.48 40.64,27.81 SJ2.2 46.48,25.91 47.24,25.15 v47.88,25.15
TX0  (via drill 0.51)
  Top 0.203: U1.47 28.5,15.8 27.94,15.24 v27.94,13.97 | v21.34,23.11 21.34,27.81
  Top 0.254: 21.34,27.81 10.16,38.99 10.16,40.64 JP9.RXI
  Bottom 0.203: JP9.RXI 6.1,44.7 6.1,51.56 6.6,52.07 48.26,52.07 J2.TX | v27.94,13.97 27.18,14.73 27.18,17.27 v21.34,23.11
TX1
  Top 0.203: U1.28 32.54,24.48 26.42,30.61 26.42,42.93 27.69,44.2 JP3.2
VCC  (via drill 0.51)
  Top 0.254: v12.93,26.44 12.93,26.9 14.1,28.07 C14.A 14.1,30.36 13.35,31.11 C13.1
  Top 0.406: U2.3 v12.93,26.44
  Top 0.508: J2.VIN 34.29,3.81 33.02,5.08 v15.24,5.08 12.7,5.08 12.03,4.41 S2.1
  Bottom 0.508: v12.93,26.44 12.93,15.01 15.24,12.7 v15.24,5.08

### Text on the board
Bottom: v23
tPlace: D0 | D1 | B1 | B3 | B2 | B0 | B4 | B5 | E7 | E6 | E5 | E4 | E3 | E2 | E1 | E0 | SCL | SDA | AREF | GND | SCK | MISO | MOSI | SSN | TX0 | RX0 | TX1 | RX1 | CLKI | TST | DTR | D7 | D6 | D5 | D4 | D3 | D2 | G5 | G2 | G1 | G0 | RX0 | TX0 | 3.3V | GND | Reset | GND | ATmega128RFA1 | Dev Board | 4.5-15V | PWR | B6 | B7 | ANALOG (PORT F) | 7 | OFF | ON | RST | 3.3V | 3.3V | GND | GND | VIN | 0 | 1 | 2 | 3 | 4 | 5 | 6
bPlace: TST | CLKI